# Altium schematic sheet FPGA_PLLs.SchDoc
size A3
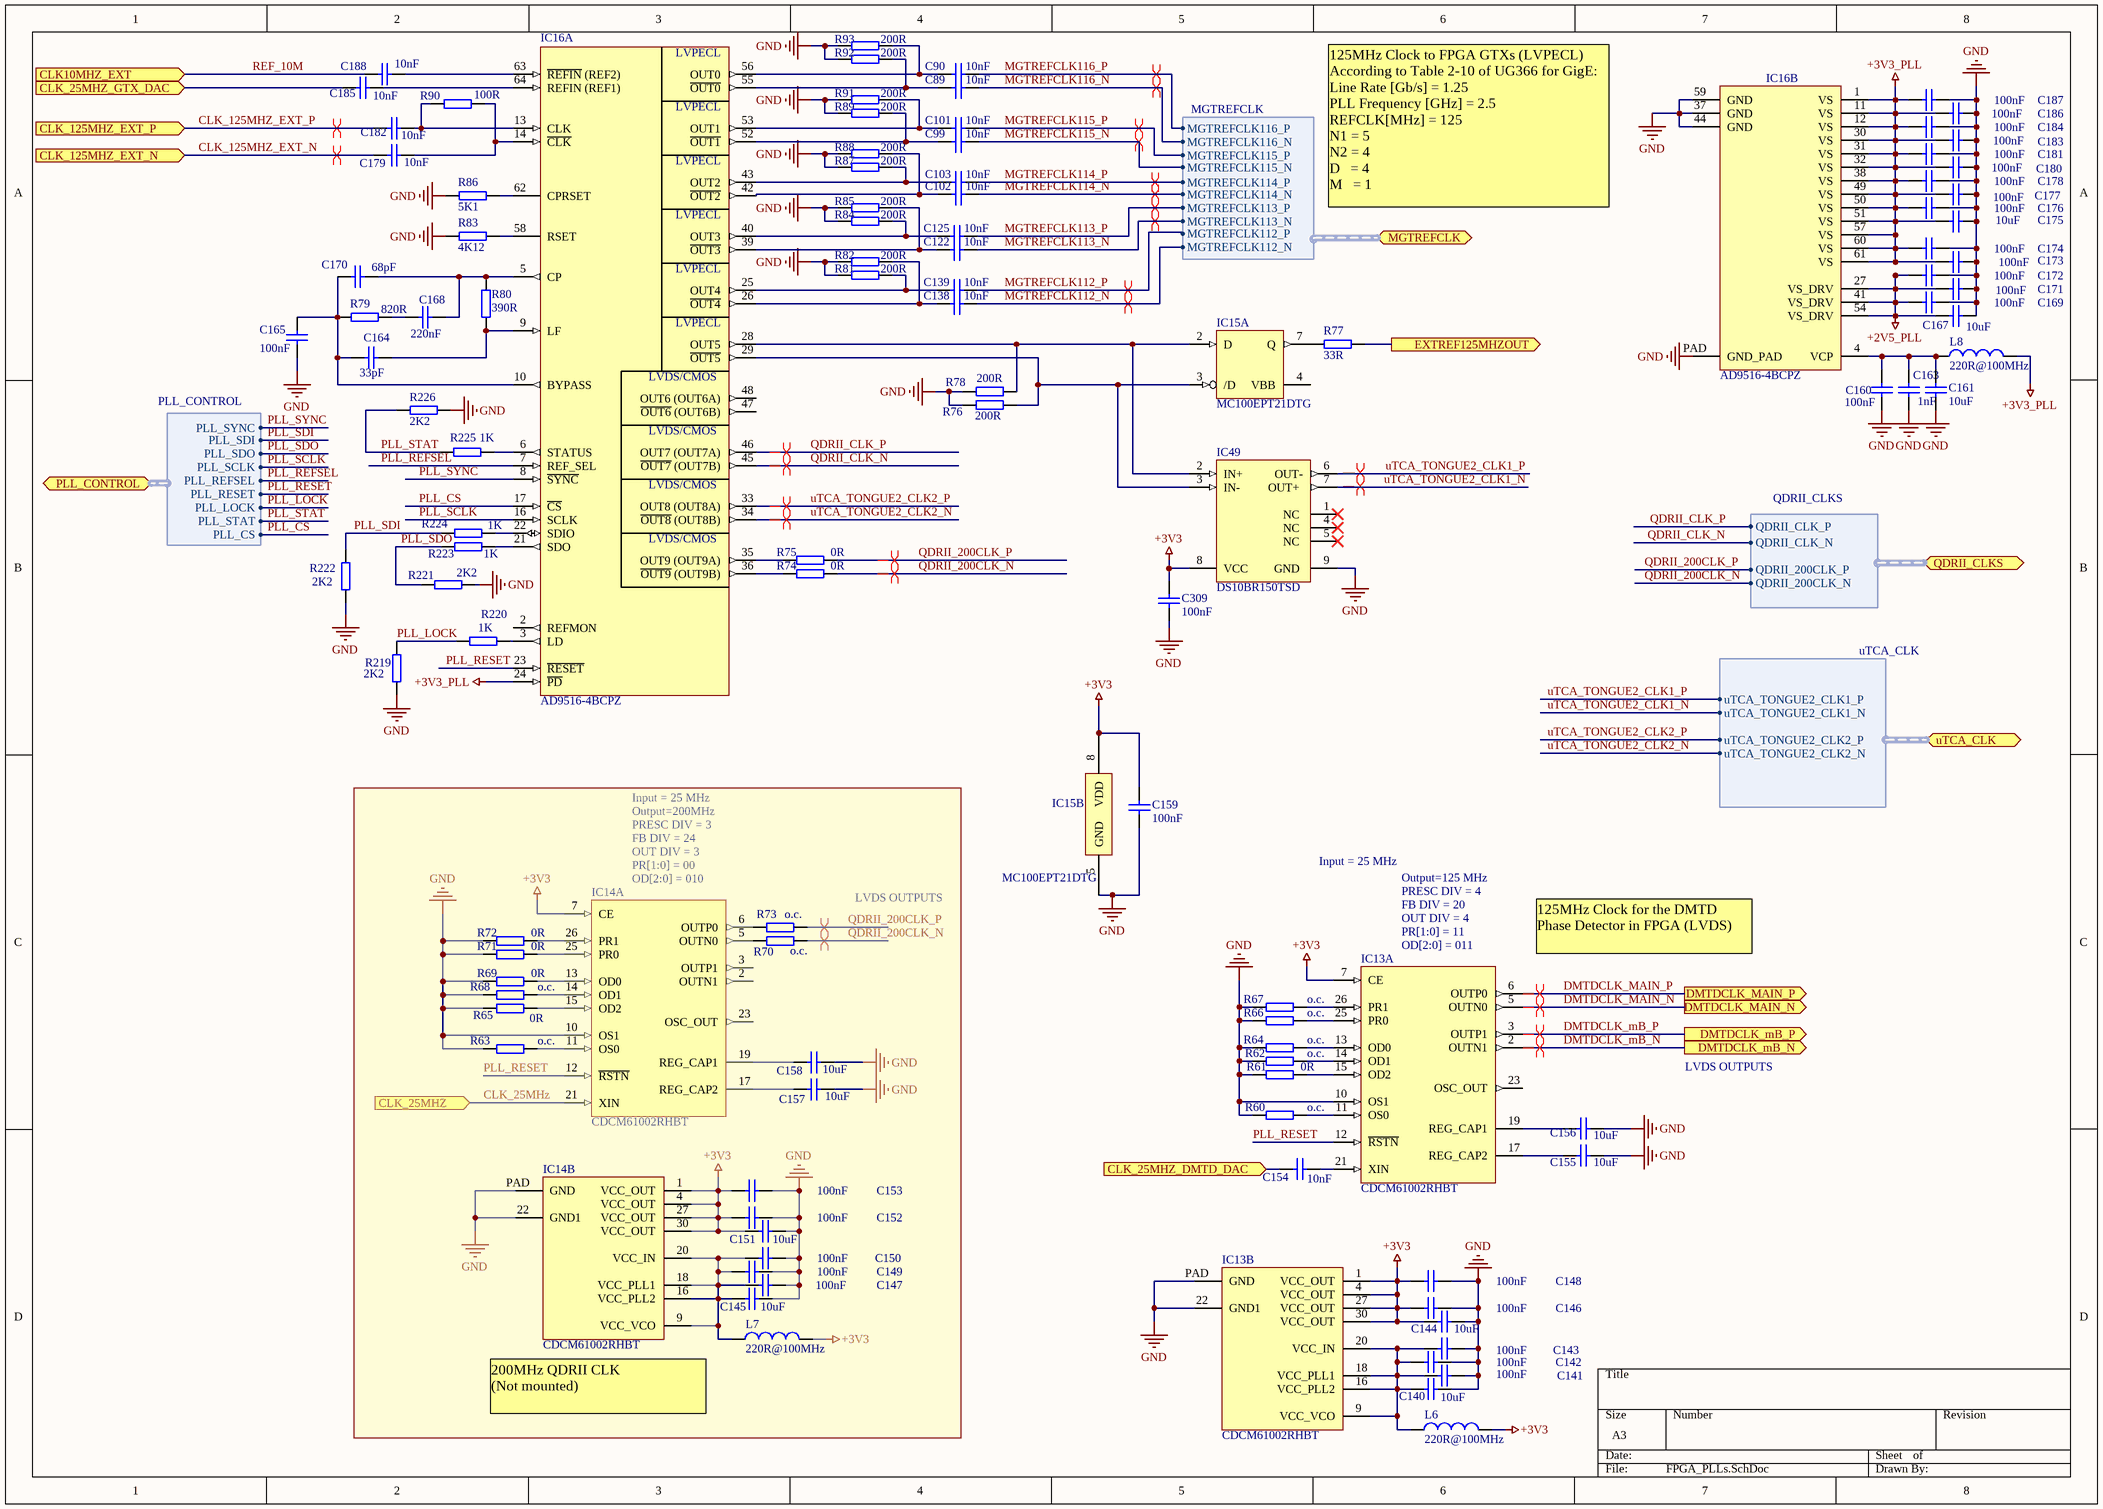
[diagram p0: FPGA_PLLs.SchDoc]

## Parts
C89  10nF  [CC1005-0402]
C90  10nF  [CC1005-0402]
C99  10nF  [CC1005-0402]
C101  10nF  [CC1005-0402]
C102  10nF  [CC1005-0402]
C103  10nF  [CC1005-0402]
C122  10nF  [CC1005-0402]
C125  10nF  [CC1005-0402]
C138  10nF  [CC1005-0402]
C139  10nF  [CC1005-0402]
C140  10uF  [CC1608-0603]
C141  100nF  [CC1005-0402]
C142  100nF  [CC1005-0402]
C143  100nF  [CC1005-0402]
C144  10uF  [CC1608-0603]
C145  10uF  [CC1608-0603]
C146  100nF  [CC1005-0402]
C147  100nF  [CC1005-0402]
C148  100nF  [CC1005-0402]
C149  100nF  [CC1005-0402]
C150  100nF  [CC1005-0402]
C151  10uF  [CC1608-0603]
C152  100nF  [CC1005-0402]
C153  100nF  [CC1005-0402]
C154  10nF  [CC1005-0402]
C155  10uF  [CC1608-0603]
C156  10uF  [CC1608-0603]
C157  10uF  [CC1608-0603]
C158  10uF  [CC1608-0603]
C159  100nF  [CC1005-0402]
C160  100nF  [CC1005-0402]
C161  10uF  [CC1608-0603]
C163  1nF  [CC1005-0402]
C164  33pF  [CC1005-0402]
C165  100nF  [CC1005-0402]
C167  10uF  [CC1608-0603]
C168  220nF  [CC1005-0402]
C169  100nF  [CC1005-0402]
C170  68pF  [CC1005-0402]
C171  100nF  [CC1005-0402]
C172  100nF  [CC1005-0402]
C173  100nF  [CC1005-0402]
C174  100nF  [CC1005-0402]
C175  10uF  [CC1608-0603]
C176  100nF  [CC1005-0402]
C177  100nF  [CC1005-0402]
C178  100nF  [CC1005-0402]
C179  10nF  [CC1005-0402]
C180  100nF  [CC1005-0402]
C181  100nF  [CC1005-0402]
C182  10nF  [CC1005-0402]
C183  100nF  [CC1005-0402]
C184  100nF  [CC1005-0402]
C185  10nF  [CC1005-0402]
C186  100nF  [CC1005-0402]
C187  100nF  [CC1005-0402]
C188  10nF  [CC1005-0402]
C309  100nF  [CC1005-0402]
IC13  CDCM61002RHBT  [QFN32_POWERPAD]  (parts A,B of 2)
IC14  CDCM61002RHBT  [QFN32_POWERPAD]  (parts A,B of 2)
IC15  MC100EPT21DTG  [TSOP65P490-8AN]  (parts A,B of 2)
IC16  AD9516-4BCPZ  [QFN50P900X900X100-64M]  (parts A,B of 2)
IC49  DS10BR150TSD  [SDA08A]
L6  Impedance: 220R@100MHz  [0603]  (hidden comment: 220R@100MHz Ferrite Bead)
L7  Impedance: 220R@100MHz  [0603]  (hidden comment: 220R@100MHz Ferrite Bead)
L8  Impedance: 220R@100MHz  [0603]  (hidden comment: 220R@100MHz Ferrite Bead)
R60  o.c.  [0402]
R61  value 0R  [0402]  (hidden comment: Jumper)
R62  o.c.  [0402]
R63  o.c.  [0402]
R64  o.c.  [0402]
R65  value 0R  [0402]  (hidden comment: Jumper)
R66  o.c.  [0402]
R67  o.c.  [0402]
R68  o.c.  [0402]
R69  value 0R  [0402]  (hidden comment: Jumper)
R70  o.c.  [0402]
R71  value 0R  [0402]  (hidden comment: Jumper)
R72  value 0R  [0402]  (hidden comment: Jumper)
R73  o.c.  [0402]
R74  value 0R  [0402]  (hidden comment: Jumper)
R75  value 0R  [0402]  (hidden comment: Jumper)
R76  200R  [0402]
R77  33R  [0603]
R78  200R  [0402]
R79  820R  [0402]
R80  390R  [0402]
R81  200R  [0402]
R82  200R  [0402]
R83  4K12  [0402]
R84  200R  [0402]
R85  200R  [0402]
R86  5K1  [0402]
R87  200R  [0402]
R88  200R  [0402]
R89  200R  [0402]
R90  100R  [0402]
R91  200R  [0402]
R92  200R  [0402]
R93  200R  [0402]
R219  2K2  [0402]
R220  1K  [0402]
R221  2K2  [0402]
R222  2K2  [0402]
R223  1K  [0402]
R224  1K  [0402]
R225  1K  [0402]
R226  2K2  [0402]

## Ports
CLK10MHZ_EXT (in), CLK_25MHZ (in), CLK_25MHZ_DMTD_DAC (in), CLK_25MHZ_GTX_DAC (in), CLK_125MHZ_EXT_N (in), CLK_125MHZ_EXT_P (in), DMTDCLK_MAIN_N (out), DMTDCLK_MAIN_P (out), DMTDCLK_mB_N (out), DMTDCLK_mB_P (out), EXTREF125MHZOUT (out), MGTREFCLK (harness MGTREFCLK), PLL_CONTROL (harness PLL_CONTROL), QDRII_CLKS (harness QDRII_CLKS), uTCA_CLK (harness uTCA_CLK)

## Harnesses
PLL_CONTROL: PLL_CS, PLL_STAT, PLL_LOCK, PLL_RESET, PLL_REFSEL, PLL_SCLK, PLL_SDO, PLL_SDI, PLL_SYNC
QDRII_CLKS: QDRII_CLK_P, QDRII_CLK_N, QDRII_200CLK_P, QDRII_200CLK_N
MGTREFCLK: MGTREFCLK112_P, MGTREFCLK112_N, MGTREFCLK113_P, MGTREFCLK113_N, MGTREFCLK114_P, MGTREFCLK114_N, MGTREFCLK115_P, MGTREFCLK115_N, MGTREFCLK116_P, MGTREFCLK116_N
uTCA_CLK: uTCA_TONGUE2_CLK1_P, uTCA_TONGUE2_CLK1_N, uTCA_TONGUE2_CLK2_P, uTCA_TONGUE2_CLK2_N

## Nets
+2V5_PLL: C167.1 C169.2 C171.2 C172.2 IC16.27(VS_DRV) IC16.41(VS_DRV) IC16.54(VS_DRV)
+3V3: C144.1 C146.2 C148.2 C151.1 C152.2 C153.2 C159.1 C309.1 IC13.1(VCC_OUT) IC13.4(VCC_OUT) IC13.7(CE) IC13.27(VCC_OUT) IC13.30(VCC_OUT) IC14.1(VCC_OUT) IC14.4(VCC_OUT) IC14.7(CE) IC14.27(VCC_OUT) IC14.30(VCC_OUT) IC15.8(VDD) IC49.8(VCC) L6.2 L7.2
+3V3_PLL: C173.2 C174.2 C175.1 C176.2 C177.2 C178.2 C180.2 C181.2 C183.2 C184.2 C186.2 C187.2 IC16.1(VS) IC16.11(VS) IC16.12(VS) IC16.24(~{PD}) IC16.30(VS) IC16.31(VS) IC16.32(VS) IC16.38(VS) IC16.49(VS) IC16.50(VS) IC16.51(VS) IC16.57(VS) IC16.60(VS) IC16.61(VS) L8.2
GND: C140.2 C141.1 C142.1 C143.1 C144.2 C145.2 C146.1 C147.1 C148.1 C149.1 C150.1 C151.2 C152.1 C153.1 C155.2 C156.2 C157.2 C158.2 C159.2 C160.2 C161.1 C163.1 C165.2 C167.2 C169.1 C171.1 C172.1 C173.1 C174.1 C175.2 C176.1 C177.1 C178.1 C180.1 C181.1 C183.1 C184.1 C186.1 C187.1 C309.2 IC13.10(OS1) IC13.22(GND1) IC13.PAD(GND) IC14.10(OS1) IC14.22(GND1) IC14.PAD(GND) IC15.5(GND) IC16.37(GND) IC16.44(GND) IC16.59(GND) IC16.PAD(GND_PAD) IC49.9(GND) R60.2 R61.1 R62.2 R63.2 R64.2 R65.1 R66.2 R67.2 R68.2 R69.1 R71.1 R72.1 R76.2 R78.2 R81.2 R82.2 R83.1 R84.2 R85.2 R86.1 R87.2 R88.2 R89.2 R91.2 R92.2 R93.2 R219.2 R221.2 R222.2 R226.2
CLK_25MHz: IC14.21(XIN) ; port CLK_25MHZ
CLK_25MHZ_DMTD_DAC: C154.2 ; port CLK_25MHZ_DMTD_DAC
CLK_25MHZ_GTX_DAC: C185.1 ; port CLK_25MHZ_GTX_DAC
CLK_125MHZ_EXT_N: C179.1 ; port CLK_125MHZ_EXT_N
CLK_125MHZ_EXT_P: C182.1 ; port CLK_125MHZ_EXT_P
DMTDCLK_MAIN_N: IC13.5(OUTN0) ; port DMTDCLK_MAIN_N
DMTDCLK_MAIN_P: IC13.6(OUTP0) ; port DMTDCLK_MAIN_P
DMTDCLK_mB_N: IC13.2(OUTN1) ; port DMTDCLK_mB_N
DMTDCLK_mB_P: IC13.3(OUTP1) ; port DMTDCLK_mB_P
EXTREF125MHZOUT: R77.2 ; port EXTREF125MHZOUT
MGTREFCLK112_N: C138.1 ; port MGTREFCLK.MGTREFCLK112_N
MGTREFCLK112_P: C139.1 ; port MGTREFCLK.MGTREFCLK112_P
MGTREFCLK113_N: C122.1 ; port MGTREFCLK.MGTREFCLK113_N
MGTREFCLK113_P: C125.1 ; port MGTREFCLK.MGTREFCLK113_P
MGTREFCLK114_N: C102.1 ; port MGTREFCLK.MGTREFCLK114_N
MGTREFCLK114_P: C103.1 ; port MGTREFCLK.MGTREFCLK114_P
MGTREFCLK115_N: C99.1 ; port MGTREFCLK.MGTREFCLK115_N
MGTREFCLK115_P: C101.1 ; port MGTREFCLK.MGTREFCLK115_P
MGTREFCLK116_N: C89.1 ; port MGTREFCLK.MGTREFCLK116_N
MGTREFCLK116_P: C90.1 ; port MGTREFCLK.MGTREFCLK116_P
PLL_CS: IC16.17(~{CS}) ; port PLL_CONTROL.PLL_CS
PLL_LOCK: R219.1 R220.2 ; port PLL_CONTROL.PLL_LOCK
PLL_REFSEL: IC16.7(REF_SEL) ; port PLL_CONTROL.PLL_REFSEL
PLL_RESET: IC13.12(~{RSTN}) IC14.12(~{RSTN}) IC16.23(~{RESET}) ; port PLL_CONTROL.PLL_RESET
PLL_SCLK: IC16.16(SCLK) ; port PLL_CONTROL.PLL_SCLK
PLL_SDI: R222.1 R224.2 ; port PLL_CONTROL.PLL_SDI
PLL_SDO: R221.1 R223.2 ; port PLL_CONTROL.PLL_SDO
PLL_STAT: R225.2 R226.1 ; port PLL_CONTROL.PLL_STAT
PLL_SYNC: IC16.8(~{SYNC}) ; port PLL_CONTROL.PLL_SYNC
QDRII_200CLK_N: R70.1 R74.2 ; port QDRII_CLKS.QDRII_200CLK_N
QDRII_200CLK_P: R73.1 R75.2 ; port QDRII_CLKS.QDRII_200CLK_P
QDRII_CLK_N: IC16.45(~{OUT7}_(OUT7B)) ; port QDRII_CLKS.QDRII_CLK_N
QDRII_CLK_P: IC16.46(OUT7_(OUT7A)) ; port QDRII_CLKS.QDRII_CLK_P
REF_10M: C188.1 ; port CLK10MHZ_EXT
uTCA_TONGUE2_CLK1_N: IC49.7(OUT+) ; port uTCA_CLK.uTCA_TONGUE2_CLK1_N
uTCA_TONGUE2_CLK1_P: IC49.6(OUT-) ; port uTCA_CLK.uTCA_TONGUE2_CLK1_P
uTCA_TONGUE2_CLK2_N: IC16.34(~{OUT8}_(OUT8B)) ; port uTCA_CLK.uTCA_TONGUE2_CLK2_N
uTCA_TONGUE2_CLK2_P: IC16.33(OUT8_(OUT8A)) ; port uTCA_CLK.uTCA_TONGUE2_CLK2_P
NetC89_2: C89.2 IC16.55(~{OUT0}) R92.1
NetC90_2: C90.2 IC16.56(OUT0) R93.1
NetC99_2: C99.2 IC16.52(~{OUT1}) R89.1
NetC101_2: C101.2 IC16.53(OUT1) R91.1
NetC102_2: C102.2 IC16.42(~{OUT2}) R88.1
NetC103_2: C103.2 IC16.43(OUT2) R87.1
NetC122_2: C122.2 IC16.39(~{OUT3}) R85.1
NetC125_2: C125.2 IC16.40(OUT3) R84.1
NetC138_2: C138.2 IC16.26(~{OUT4}) R82.1
NetC139_2: C139.2 IC16.25(OUT4) R81.1
NetC140_1: C140.1 C141.2 C142.2 C143.2 IC13.9(VCC_VCO) IC13.16(VCC_PLL2) IC13.18(VCC_PLL1) IC13.20(VCC_IN) L6.1
NetC145_1: C145.1 C147.2 C149.2 C150.2 IC14.9(VCC_VCO) IC14.16(VCC_PLL2) IC14.18(VCC_PLL1) IC14.20(VCC_IN) L7.1
NetC154_1: C154.1 IC13.21(XIN)
NetC155_1: C155.1 IC13.17(REG_CAP2)
NetC156_1: C156.1 IC13.19(REG_CAP1)
NetC157_1: C157.1 IC14.17(REG_CAP2)
NetC158_1: C158.1 IC14.19(REG_CAP1)
NetC160_1: C160.1 C161.2 C163.2 IC16.4(VCP) L8.1
NetC164_1: C164.1 C165.1 C170.1 IC16.10(BYPASS) R79.1
NetC164_2: C164.2 IC16.9(LF) R80.1
NetC168_1: C168.1 R79.2
NetC168_2: C168.2 C170.2 IC16.5(CP) R80.2
NetC179_2: C179.2 IC16.14(~{CLK}) R90.1
NetC182_2: C182.2 IC16.13(CLK) R90.2
NetC185_2: C185.2 IC16.64(REFIN_(REF1))
NetC188_2: C188.2 IC16.63(~{REFIN}_(REF2))
NetIC13_11: IC13.11(OS0) R60.1
NetIC13_13: IC13.13(OD0) R64.1
NetIC13_14: IC13.14(OD1) R62.1
NetIC13_15: IC13.15(OD2) R61.2
NetIC13_25: IC13.25(PR0) R66.1
NetIC13_26: IC13.26(PR1) R67.1
NetIC14_5: IC14.5(OUTN0) R70.2
NetIC14_6: IC14.6(OUTP0) R73.2
NetIC14_11: IC14.11(OS0) R63.1
NetIC14_13: IC14.13(OD0) R69.2
NetIC14_14: IC14.14(OD1) R68.1
NetIC14_15: IC14.15(OD2) R65.2
NetIC14_25: IC14.25(PR0) R71.2
NetIC14_26: IC14.26(PR1) R72.2
NetIC15_2: IC15.2(D) IC16.28(OUT5) IC49.2(IN+) R78.1
NetIC15_3: IC15.3(/D) IC16.29(~{OUT5}) IC49.3(IN-) R76.1
NetIC15_7: IC15.7(Q) R77.1
NetIC16_3: IC16.3(LD) R220.1
NetIC16_6: IC16.6(STATUS) R225.1
NetIC16_21: IC16.21(SDO) R223.1
NetIC16_22: IC16.22(SDIO) R224.1
NetIC16_35: IC16.35(OUT9_(OUT9A)) R75.1
NetIC16_36: IC16.36(~{OUT9}_(OUT9B)) R74.1
NetIC16_58: IC16.58(RSET) R83.2
NetIC16_62: IC16.62(CPRSET) R86.2

Not connected (* = marked no-connect by the designer): IC13 23(OSC_OUT); IC14 2(OUTN1) 3(OUTP1) 23(OSC_OUT); IC15 4(VBB); IC16 2(REFMON) 47(~{OUT6}_(OUT6B)) 48(OUT6_(OUT6A)); IC49 1(NC_)* 4(NC_)* 5(NC_)*

## Layout directives
differential pair: (no net found under the mark), CLK_125MHZ_EXT_N, CLK_125MHZ_EXT_P, DMTDCLK_MAIN_N, DMTDCLK_MAIN_P, DMTDCLK_mB_N, DMTDCLK_mB_P, MGTREFCLK112_N, MGTREFCLK112_P, MGTREFCLK113_N, MGTREFCLK113_P, MGTREFCLK114_N, MGTREFCLK114_P, MGTREFCLK115_N, MGTREFCLK115_P, MGTREFCLK116_N, MGTREFCLK116_P, QDRII_200CLK_N, QDRII_200CLK_P, QDRII_CLK_N, QDRII_CLK_P, uTCA_TONGUE2_CLK2_N, uTCA_TONGUE2_CLK2_P

## Notes on the sheet
- 125MHz Clock to FPGA GTXs (LVPECL)
  According to Table 2-10 of UG366 for GigE:
  Line Rate [Gb/s] = 1.25
  PLL Frequency [GHz] = 2.5
  REFCLK[MHz] = 125
  N1 = 5
  N2 = 4
  D   = 4
  M   = 1
- Output=200MHz
- PRESC DIV = 3
- FB DIV = 24
- OUT DIV = 3
- Input = 25 MHz
- (near IC14) PR[1:0] = 00
- (near IC14) OD[2:0] = 010
- LVDS OUTPUTS
- Output=125 MHz
- PRESC DIV = 4
- FB DIV = 20
- OUT DIV = 4
- (near IC13) PR[1:0] = 11
- (near IC13) OD[2:0] = 011
- (near IC13) 125MHz Clock for the DMTD Phase Detector in FPGA (LVDS)
- 200MHz QDRII CLK
  (Not mounted)
- (in symbol AD9516, part A) LVPECL; LVDS/CMOS

## Library data of the parts
C89 C90 C99 C101-C103 C122 C125 C138 C139 C154 C179 C182 C185 C188 = CC0402_10NF_25V_10%_X7R: Capacitor; Manufacturer1: TDK; Manufacturer1 PN: C1005X7R1E103K; TC: X7R; Tolerance: ±10%; Voltage: 25V; Published: 8-Jun-2000; LatestRevisionDate: 17-Jul-2002; LatestRevisionNote: Re-released for DXP Platform.; PackageReference: RAD-0.3; Publisher: Altium Limited; Distributor1: Digikey; Distributor1 PN: 445-1260-1-ND; Case: 0402; Value: 10nF
C140 C144 C145 C151 C155-C158 C161 C167 C175 = CC0603_10UF_6.3V_20%_X5R: Capacitor; Manufacturer1: TDK; Manufacturer1 PN: C1608X5R0J106M; TC: X5R; Tolerance: ±20%; Voltage: 6.3V; Published: 8-Jun-2000; LatestRevisionDate: 17-Jul-2002; LatestRevisionNote: Re-released for DXP Platform.; PackageReference: RAD-0.3; Publisher: Altium Limited; Distributor1: Digikey; Distributor1 PN: 445-4112-1-ND; Case: 0603; Value: 10uF
C141-C143 C146-C150 C152 C153 C159 C160 C165 C169 C171-C174 C176-C178 C180 C181 C183 C184 C186 C187 C309 = CC0402_100NF_16V_10%_X7R: Capacitor; Manufacturer1: TDK; Manufacturer1 PN: C1005X7R1C104K; TC: X7R; Tolerance: ±10%; Voltage: 16V; Published: 8-Jun-2000; LatestRevisionDate: 17-Jul-2002; LatestRevisionNote: Re-released for DXP Platform.; PackageReference: RAD-0.3; Publisher: Altium Limited; Distributor1: Digikey; Distributor1 PN: 445-4952-1-ND; Case: 0402; Value: 100nF
C163 = CC0402_1NF_25V_10%_X7R: Capacitor; Manufacturer1: TDK; Manufacturer1 PN: C1005X7R1E102K; TC: X7R; Tolerance: ±10%; Voltage: 25V; Published: 8-Jun-2000; LatestRevisionDate: 17-Jul-2002; LatestRevisionNote: Re-released for DXP Platform.; PackageReference: RAD-0.3; Publisher: Altium Limited; Distributor1: Digikey; Distributor1 PN: 445-4924-1-ND; Case: 0402; Value: 1nF
C164 = CC0402_33PF_50V_5%_NP0: Capacitor; Manufacturer1: TDK; Manufacturer1 PN: C1005C0G1H330J; TC: NP0; Tolerance: ±5%; Voltage: 50V; Published: 8-Jun-2000; LatestRevisionDate: 17-Jul-2002; LatestRevisionNote: Re-released for DXP Platform.; PackageReference: RAD-0.3; Publisher: Altium Limited; Distributor1: Digikey; Distributor1 PN: 445-1241-1-ND; Case: 0402; Value: 33pF
C168 = CC0402_220NF_16V_10%_X7R: Capacitor; Manufacturer1: TDK; Manufacturer1 PN: C1005X7R1C224K; TC: X7R; Tolerance: ±10%; Voltage: 16V; Published: 8-Jun-2000; LatestRevisionDate: 17-Jul-2002; LatestRevisionNote: Re-released for DXP Platform.; PackageReference: RAD-0.3; Publisher: Altium Limited; Distributor1: Digikey; Distributor1 PN: 445-5936-1-ND; Case: 0402; Value: 220nF
C170 = CC0402_68PF_50V_5%_NP0: Capacitor; Manufacturer1: TDK; Manufacturer1 PN: C1005C0G1H680J; TC: NP0; Tolerance: ±5%; Voltage: 50V; Published: 8-Jun-2000; LatestRevisionDate: 17-Jul-2002; LatestRevisionNote: Re-released for DXP Platform.; PackageReference: RAD-0.3; Publisher: Altium Limited; Distributor1: Digikey; Distributor1 PN: 445-1245-1-ND; Case: 0402; Value: 68pF
IC13 IC14 = CDCM61002: Low Jitter Clock Generator, Two Outpust, Integrated VCO; Manufacturer: Texas Instruments; Value: CDCM61002RHBT; Distributor1: Digikey; Distributor1 PN: 296-24193-1-ND
IC15 = MC100EPT21: ONSemi LVDS/LVPECL -> LVTTL/LVCMOS buffer; RefId: MC100EPT21DTGOS-ND; Supplier: Digikey; Value: MC100EPT21DTG
IC16 = AD9516: PLL with clock fanout; Value: AD9516-4BCPZ; Distributor1 PN: AD9516-4BCPZ-ND; Distributor1: Digikey
IC49 = DS10BR150TSD: 1.0 Gbps LVDS Buffer/Repeater; Manufacturer: National Semiconductor; CompType: Interface IC; PackageTopMarking: ZXYTT*1R150; PowerWise: N; Published: 4-Dec-2008; DatasheetVersion: Nov-2007; PackageVersion: revA, Aug-2003; PackageReference: SDA08A; Publisher: Altium Limited; PackageDescription: LLP, Plastic, Dual, 3 x 3 x 0.8mm Body, 8 Lead, 0.5mm Pitch, No Pullback; PartNumber: DS10BR150TSD; RoHS: Y; PinCount: 8; DigiKeyPartNumber: DS10BR150TSDTR-ND; ComponentLink1Description: DS10BR150 Datasheet; ComponentLink1URL: http://www.national.com/ds/DS/DS10BR150.pdf; ComponentLink2Description: DS10BR150 Web Page; ComponentLink2URL: http://www.national.com/pf/DS/DS10BR150.html; ComponentLink3Description: SDA08A Package Page; ComponentLink3URL: http://www.national.com/packaging/folders/sda08a.html
L6-L8 = L_FERRITE_BEAD: ferrite bead; Manufacturer1: Murata; Manufacturer1 PN: BLM18KG221SN1D; Current Rating: 2.2A; DCR: 50mOhm; Case: 0603; Distributor1: Digikey; Distributor1 PN: 490-5255-1-ND
R60 R62-R64 R66-R68 R70 R73 = R0402_O.C.: SMD Resistor; Case: 0402; Manufacturer1: N/A; Manufacturer1 PN: N/A; Distributor1: N/A; Distributor1 PN: N/A; TCR: N/A; Power Rating: N/A; Tolerance: N/A; Value: o.c.
R61 R65 R69 R71 R72 R74 R75 = R0402_0R_0.1W_JUMPER: SMD Resistor; Manufacturer1: Panasonic; Manufacturer1 PN: ERJ-2GE0R00X; TCR: 100ppm; Power Rating: 0.1W; Case: 0402; Distributor1: DigiKey; Distributor1 PN: P0.0JCT-ND; Tolerance: Jumper
R76 R78 R81 R82 R84 R85 R87-R89 R91-R93 = R0402_200R_±1%_0.1W_100PPM: SMD Resistor; Manufacturer1: Panasonic; Manufacturer1 PN: ERJ-2RKF2000X; TCR: 100ppm; Power Rating: 0.1W; Tolerance: ±1%; Case: 0402; Distributor1: DigiKey; Distributor1 PN: P200LCT-ND; Value: 200R
R77 = R0603_33R_±1%_0.25W_100PPM: SMD Resistor; Manufacturer1: Vishay/Dale; Manufacturer1 PN: CRCW060333R0FKEAHP; TCR: 100ppm; Power Rating: 0.25W; Tolerance: ±1%; Case: 0402; Distributor1: DigiKey; Distributor1 PN: 541-33.0SCT-ND; Value: 33R
R79 = R0402_820R_±1%_0.1W_100PPM: SMD Resistor; Manufacturer1: Panasonic; Manufacturer1 PN: ERJ-2RKF8200X; TCR: 100ppm; Power Rating: 0.1W; Tolerance: ±1%; Case: 0402; Distributor1: DigiKey; Distributor1 PN: P820LCT-ND; Value: 820R
R80 = R0402_390R_±1%_0.1W_100PPM: SMD Resistor; Manufacturer1: Panasonic; Manufacturer1 PN: ERJ-2RKF3900X; TCR: 100ppm; Power Rating: 0.1W; Tolerance: ±1%; Case: 0402; Distributor1: DigiKey; Distributor1 PN: P390LCT-ND; Value: 390R
R83 = R0402_4K12_±1%_0.1W_100PPM: SMD Resistor; Manufacturer1: Panasonic; Manufacturer1 PN: ERJ-2RKF4121X; TCR: 100ppm; Power Rating: 0.1W; Tolerance: ±1%; Case: 0402; Distributor1: DigiKey; Distributor1 PN: P4.12KLCT-ND; Value: 4K12
R86 = R0402_5K1_±1%_0.1W_100PPM: SMD Resistor; Manufacturer1: Panasonic; Manufacturer1 PN: ERJ-2RKF5101X; TCR: 100ppm; Power Rating: 0.1W; Tolerance: ±1%; Case: 0402; Distributor1: DigiKey; Distributor1 PN: P5.10KLCT-ND; Value: 5K1
R90 = R0402_100R_±1%_0.1W_100PPM: SMD Resistor; Manufacturer1: Panasonic; Manufacturer1 PN: ERJ-2RKF1000X; TCR: 100ppm; Power Rating: 0.1W; Tolerance: ±1%; Case: 0402; Distributor1: DigiKey; Distributor1 PN: P100LCT-ND; Value: 100R
R219 R221 R222 R226 = R0402_2K2_±1%_0.1W_100PPM: SMD Resistor; Manufacturer1: Panasonic; Manufacturer1 PN: ERJ-2RKF2201X; TCR: 100ppm; Power Rating: 0.1W; Tolerance: ±1%; Case: 0402; Distributor1: DigiKey; Distributor1 PN: P2.20KLCT-ND; Value: 2K2
R220 R223-R225 = R0402_1K_±1%_0.1W_100PPM: SMD Resistor; Manufacturer1: Panasonic; Manufacturer1 PN: ERJ-2RKF1001X; TCR: 100ppm; Power Rating: 0.1W; Tolerance: ±1%; Case: 0402; Distributor1: DigiKey; Distributor1 PN: P1.00KLCT-ND; Value: 1K